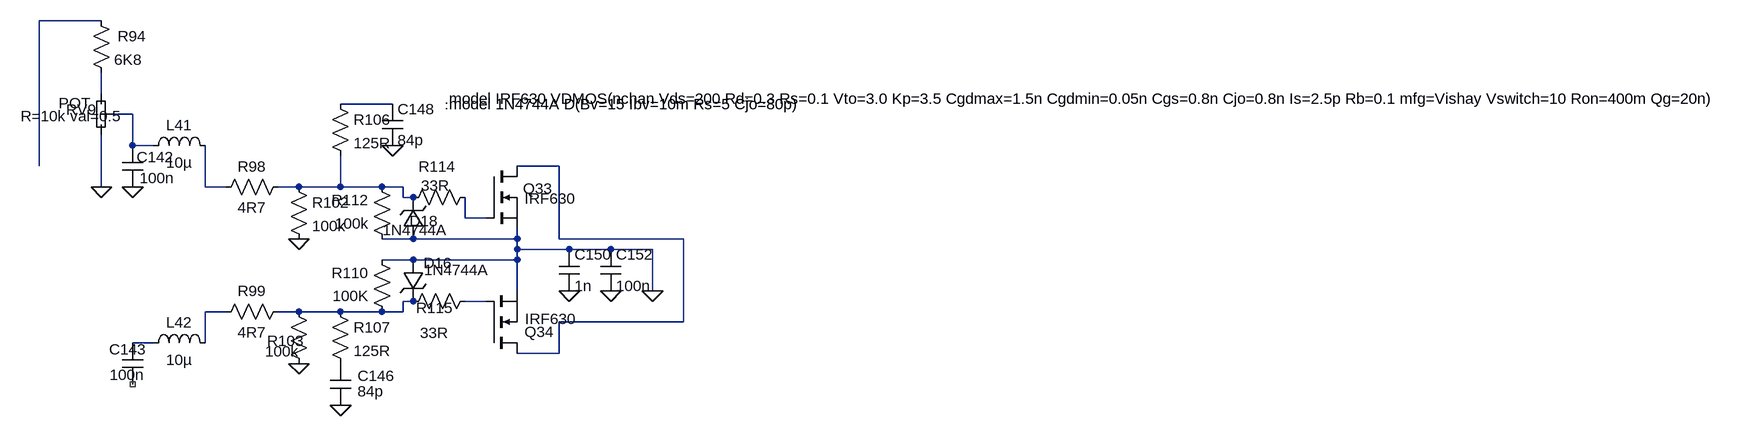
[diagram p0: schematic DRV, PA.asc]
DRV, PA.asc, the LTspice schematic file:
Version 4.1
SHEET 1 2220 680
WIRE -336 -208 -432 -208
WIRE -336 -96 -336 -128
WIRE 112 -80 32 -80
WIRE -288 -64 -320 -64
WIRE -288 -16 -288 -64
WIRE -256 -16 -288 -16
WIRE -432 16 -432 -208
WIRE 368 16 304 16
WIRE -336 48 -336 -32
WIRE -176 48 -176 -16
WIRE -144 48 -176 48
WIRE -32 48 -64 48
WIRE 32 48 32 0
WIRE 32 48 -32 48
WIRE 96 48 32 48
WIRE 128 48 96 48
WIRE 128 64 128 48
WIRE 144 64 128 64
WIRE 224 96 224 64
WIRE 256 96 224 96
WIRE 144 128 96 128
WIRE 304 128 304 112
WIRE 304 128 144 128
WIRE 368 128 368 16
WIRE 560 128 368 128
WIRE 304 144 304 128
WIRE 384 144 304 144
WIRE 448 144 384 144
WIRE 512 144 448 144
WIRE 144 160 96 160
WIRE 304 160 304 144
WIRE 304 160 144 160
WIRE 304 208 304 160
WIRE 512 208 512 144
WIRE 144 224 128 224
WIRE 256 224 224 224
WIRE -144 240 -176 240
WIRE -32 240 -64 240
WIRE 32 240 -32 240
WIRE 96 240 32 240
WIRE 128 240 128 224
WIRE 128 240 96 240
WIRE 560 256 560 128
WIRE 560 256 368 256
WIRE -256 288 -288 288
WIRE -176 288 -176 240
WIRE 368 304 368 256
WIRE 368 304 304 304
FLAG 384 208 0
FLAG 448 208 0
FLAG 512 208 0
FLAG 112 -16 0
FLAG -32 128 0
FLAG -32 320 0
FLAG 32 384 0
FLAG -288 48 0
FLAG -336 48 0
SYMBOL nmos 256 16 R0
WINDOW 0 57 34 Left 0
WINDOW 3 59 50 Left 0
SYMATTR InstName Q33
SYMATTR Value IRF630
SYMBOL nmos 256 304 M180
WINDOW 0 59 33 Left 0
WINDOW 3 60 53 Left 0
SYMATTR InstName Q34
SYMATTR Value IRF630
SYMBOL res 240 208 R90
WINDOW 0 42 63 VBottom 0
WINDOW 3 49 63 VTop 0
SYMATTR InstName R115
SYMATTR Value 33R
SYMBOL res 240 48 R90
WINDOW 0 -16 59 VBottom 0
WINDOW 3 -18 62 VTop 0
SYMATTR InstName R114
SYMATTR Value 33R
SYMBOL cap 368 144 R0
WINDOW 0 24 8 Left 0
WINDOW 3 24 56 Left 0
SYMATTR InstName C150
SYMATTR Value 1n
SYMBOL cap 432 144 R0
WINDOW 0 24 8 Left 0
WINDOW 3 24 56 Left 0
SYMATTR InstName C152
SYMATTR Value 100n
SYMBOL zener 160 128 R180
WINDOW 0 -23 28 Left 0
WINDOW 3 -37 14 Left 0
SYMATTR InstName D18
SYMATTR Value 1N4744A
SYMBOL zener 128 160 R0
WINDOW 0 32 5 Left 0
WINDOW 3 33 16 Left 0
SYMATTR InstName D16
SYMATTR Value 1N4744A
SYMBOL res 112 144 R180
WINDOW 0 36 76 Left 0
WINDOW 3 36 40 Left 0
SYMATTR InstName R112
SYMATTR Value 100k
SYMBOL res 112 256 R180
WINDOW 0 36 76 Left 0
WINDOW 3 36 40 Left 0
SYMATTR InstName R110
SYMATTR Value 100K
SYMBOL res -48 32 R90
WINDOW 0 0 56 VBottom 0
WINDOW 3 32 56 VTop 0
SYMATTR InstName R98
SYMATTR Value 4R7
SYMBOL res -48 224 R90
WINDOW 0 0 56 VBottom 0
WINDOW 3 32 56 VTop 0
SYMATTR InstName R99
SYMATTR Value 4R7
SYMBOL res 16 -96 R0
WINDOW 0 36 40 Left 0
WINDOW 3 36 76 Left 0
SYMATTR InstName R106
SYMATTR Value 125R
SYMBOL cap 96 -80 R0
WINDOW 0 24 8 Left 0
WINDOW 3 24 56 Left 0
SYMATTR InstName C148
SYMATTR Value 84p
SYMBOL res -48 32 R0
WINDOW 0 36 40 Left 0
WINDOW 3 36 76 Left 0
SYMATTR InstName R102
SYMATTR Value 100k
SYMBOL res -48 224 R0
WINDOW 0 -33 61 Left 0
WINDOW 3 -36 77 Left 0
SYMATTR InstName R103
SYMATTR Value 100k
SYMBOL res 16 224 R0
WINDOW 0 36 40 Left 0
WINDOW 3 36 76 Left 0
SYMATTR InstName R107
SYMATTR Value 125R
SYMBOL cap 16 320 R0
WINDOW 0 42 19 Left 0
WINDOW 3 42 43 Left 0
SYMATTR InstName C146
SYMATTR Value 84p
SYMBOL ind -272 0 R270
WINDOW 0 32 56 VTop 0
WINDOW 3 5 56 VBottom 0
SYMATTR InstName L41
SYMATTR Value 10µ
SYMATTR SpiceLine Rser=1m
SYMBOL ind -272 304 R270
WINDOW 0 32 56 VTop 0
WINDOW 3 5 56 VBottom 0
SYMATTR InstName L42
SYMATTR Value 10µ
SYMATTR SpiceLine Rser=1m
SYMBOL cap -304 -16 R0
WINDOW 0 22 18 Left 0
WINDOW 3 27 50 Left 0
SYMATTR InstName C142
SYMATTR Value 100n
SYMBOL cap -304 288 R0
WINDOW 0 -20 10 Left 0
WINDOW 3 -19 49 Left 0
SYMATTR InstName C143
SYMATTR Value 100n
SYMBOL res -352 -224 R0
WINDOW 0 41 40 Left 0
WINDOW 3 36 76 Left 0
SYMATTR InstName R94
SYMATTR Value 6K8
SYMBOL lib\\sym\\MyParts\\POT -336 -64 R0
SYMATTR InstName RV9
TEXT 192 -88 Left 0 !.model IRF630 VDMOS(nchan Vds=200 Rd=0.3 Rs=0.1 Vto=3.0 Kp=3.5 Cgdmax=1.5n Cgdmin=0.05n Cgs=0.8n Cjo=0.8n Is=2.5p Rb=0.1 mfg=Vishay Vswitch=10 Ron=400m Qg=20n)
TEXT 192 -80 Left 0 !.model 1N4744A D(Bv=15 Ibv=10m Rs=5 Cjo=80p)

The netlist it stands for:
* DRV, PA.asc
M§Q33 N005 N008 0 0 IRF630
M§Q34 N005 N010 0 0 IRF630
R115 N010 N009 33R
R114 N008 N007 33R
C150 0 0 1n
C152 0 0 100n
D18 0 N007 1N4744A
D16 0 N009 1N4744A
R112 0 N007 100k
R110 N009 0 100K
R98 N007 N006 4R7
R99 N009 N011 4R7
R106 N003 N007 125R
C148 N003 0 84p
R102 N007 0 100k
R103 N009 0 100k
R107 N009 P001 125R
C146 P001 0 84p
L41 N004 N006 10µ Rser=1m
L42 N012 N011 10µ Rser=1m
C142 N004 0 100n
C143 N012 NC_01 100n
R94 N001 N002 6K8
X§RV9 0 N004 N002 POT POT R=10k val=0.5  ; pins 1 2 3
.model D D
.lib standard.dio
.model NMOS NMOS
.model PMOS PMOS
.lib standard.mos
.model IRF630 VDMOS(nchan Vds=200 Rd=0.3 Rs=0.1 Vto=3.0 Kp=3.5 Cgdmax=1.5n Cgdmin=0.05n Cgs=0.8n Cjo=0.8n Is=2.5p Rb=0.1 mfg=Vishay Vswitch=10 Ron=400m Qg=20n)
.model 1N4744A D(Bv=15 Ibv=10m Rs=5 Cjo=80p)
.lib POT.lib
.backanno
.end